# EAGLE schematic bigger_board (EAGLE 6.5.0)
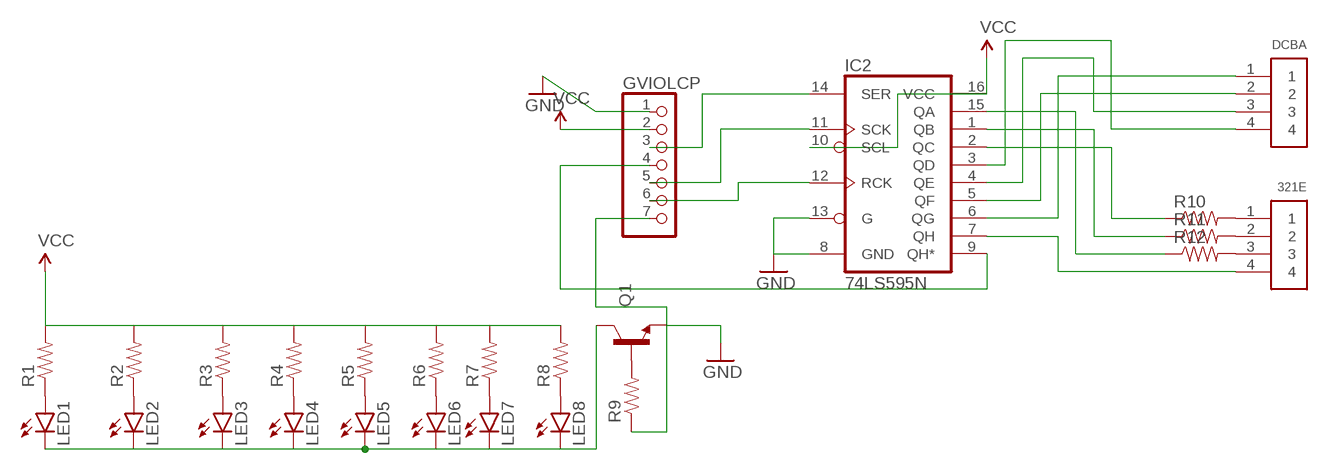
[diagram p0: schematic, sheet 1]

## Parts
321E  1X4-BIG  [1X04-BIG]
DCBA  1X4-BIG  [1X04-BIG]
GVIOLCP  PINHD-1X7  [1X07]
IC2  74LS595N  [DIL16]
LED1  LED3MM  [LED3MM]
LED2  LED3MM  [LED3MM]
LED3  LED3MM  [LED3MM]
LED4  LED3MM  [LED3MM]
LED5  LED3MM  [LED3MM]
LED6  LED3MM  [LED3MM]
LED7  LED3MM  [LED3MM]
LED8  LED3MM  [LED3MM]
Q1  TRANSISTOR_NPNBC547  [TO-92-AMMO]
R1  RESISTOR1206  [1206]
R2  RESISTOR1206  [1206]
R3  RESISTOR1206  [1206]
R4  RESISTOR1206  [1206]
R5  RESISTOR1206  [1206]
R6  RESISTOR1206  [1206]
R7  RESISTOR1206  [1206]
R8  RESISTOR1206  [1206]
R9  RESISTOR1206  [1206]
R10  RESISTOR1206  [1206]
R11  RESISTOR1206  [1206]
R12  RESISTOR1206  [1206]

## Nets
GND: GVIOLCP.1 IC2.8(GND) IC2.13(G) Q1.3(E)
N$1: IC2.15(QA) R12.1
N$2: IC2.1(QB) R11.1
N$3: IC2.2(QC) R10.1
N$4: DCBA.1 IC2.6(QG)
N$5: DCBA.2 IC2.5(QF)
N$6: DCBA.3 IC2.4(QE)
N$7: DCBA.4 IC2.3(QD)
N$8: 321E.4 IC2.7(QH)
N$9: LED3.A R3.1
N$10: LED4.A R4.1
N$11: LED5.A R5.1
N$12: LED6.A R6.1
N$13: LED7.A R7.1
N$14: LED8.A R8.1
N$15: LED1.A R1.1
N$16: LED2.A R2.1
N$17: Q1.2(B) R9.2
N$19: GVIOLCP.7 R9.1
N$20: GVIOLCP.3 IC2.14(SER)
N$21: GVIOLCP.4 IC2.9(QH*)
N$22: GVIOLCP.5 IC2.11(SCK)
N$23: GVIOLCP.6 IC2.12(RCK)
N$24: 321E.3 R12.2
N$25: 321E.1 R10.2
N$26: 321E.2 R11.2
N$27: LED1.K(C) LED2.K(C) LED3.K(C) LED4.K(C) LED5.K(C) LED6.K(C) LED7.K(C) LED8.K(C) Q1.1(C)
VCC: GVIOLCP.2 IC2.10(SCL) IC2.16(VCC) R1.2 R2.2 R3.2 R4.2 R5.2 R6.2 R7.2 R8.2

## Library data of the parts
321E DCBA = adafruit:1X4: 4-pin connector
GVIOLCP = pinhead:PINHD-1X7: PIN HEADER
IC2 = SparkFun-DigitalIC:74*595: 8-bit SHIFT REGISTER, output latch
LED1-LED8 = SparkFun-LED:LED: LEDs Standard schematic elements and footprints for 5mm, 3mm, 1206, and 0603 sized LEDs. 5mm - Spark Fun Electronics SKU : COM-00529 (and others)
Q1 = SparkFun-DiscreteSemi:TRANSISTOR_NPN: Generic NPN BJT MMBT2222A - TRANS-08049 (SOT-23, 1A 40V) MPSA42 - TRANS-09116 (SOT-23, 500mA 300V) MMBT5088LT1G - TRANS-11160 (SOT-23, 50 mA 30V) BC547 - COM-08928 <http://www.sparkfun.com/products/8928> (TO-92 45V 100mA) (1.Collector 2.Base 3.Emitter) 2N3904 - COM-00521 <http://www.sparkfun.com/products/521> (TO-92 40V 200mA) (1.Emitter 2.Base 3.Collector) P2N2222A - COM-12852 <http://www.sparkfun.com/products/12852> (TO-92 40V 600mA) (1.Collector 2.Base 3.Emitter)
R1-R12 = SparkFun-Resistors:RESISTOR: Resistor Basic schematic elements and footprints for 0603, 1206, and PTH resistors.